# Altium schematic sheet EnclosurePinout.SchDoc
size A3
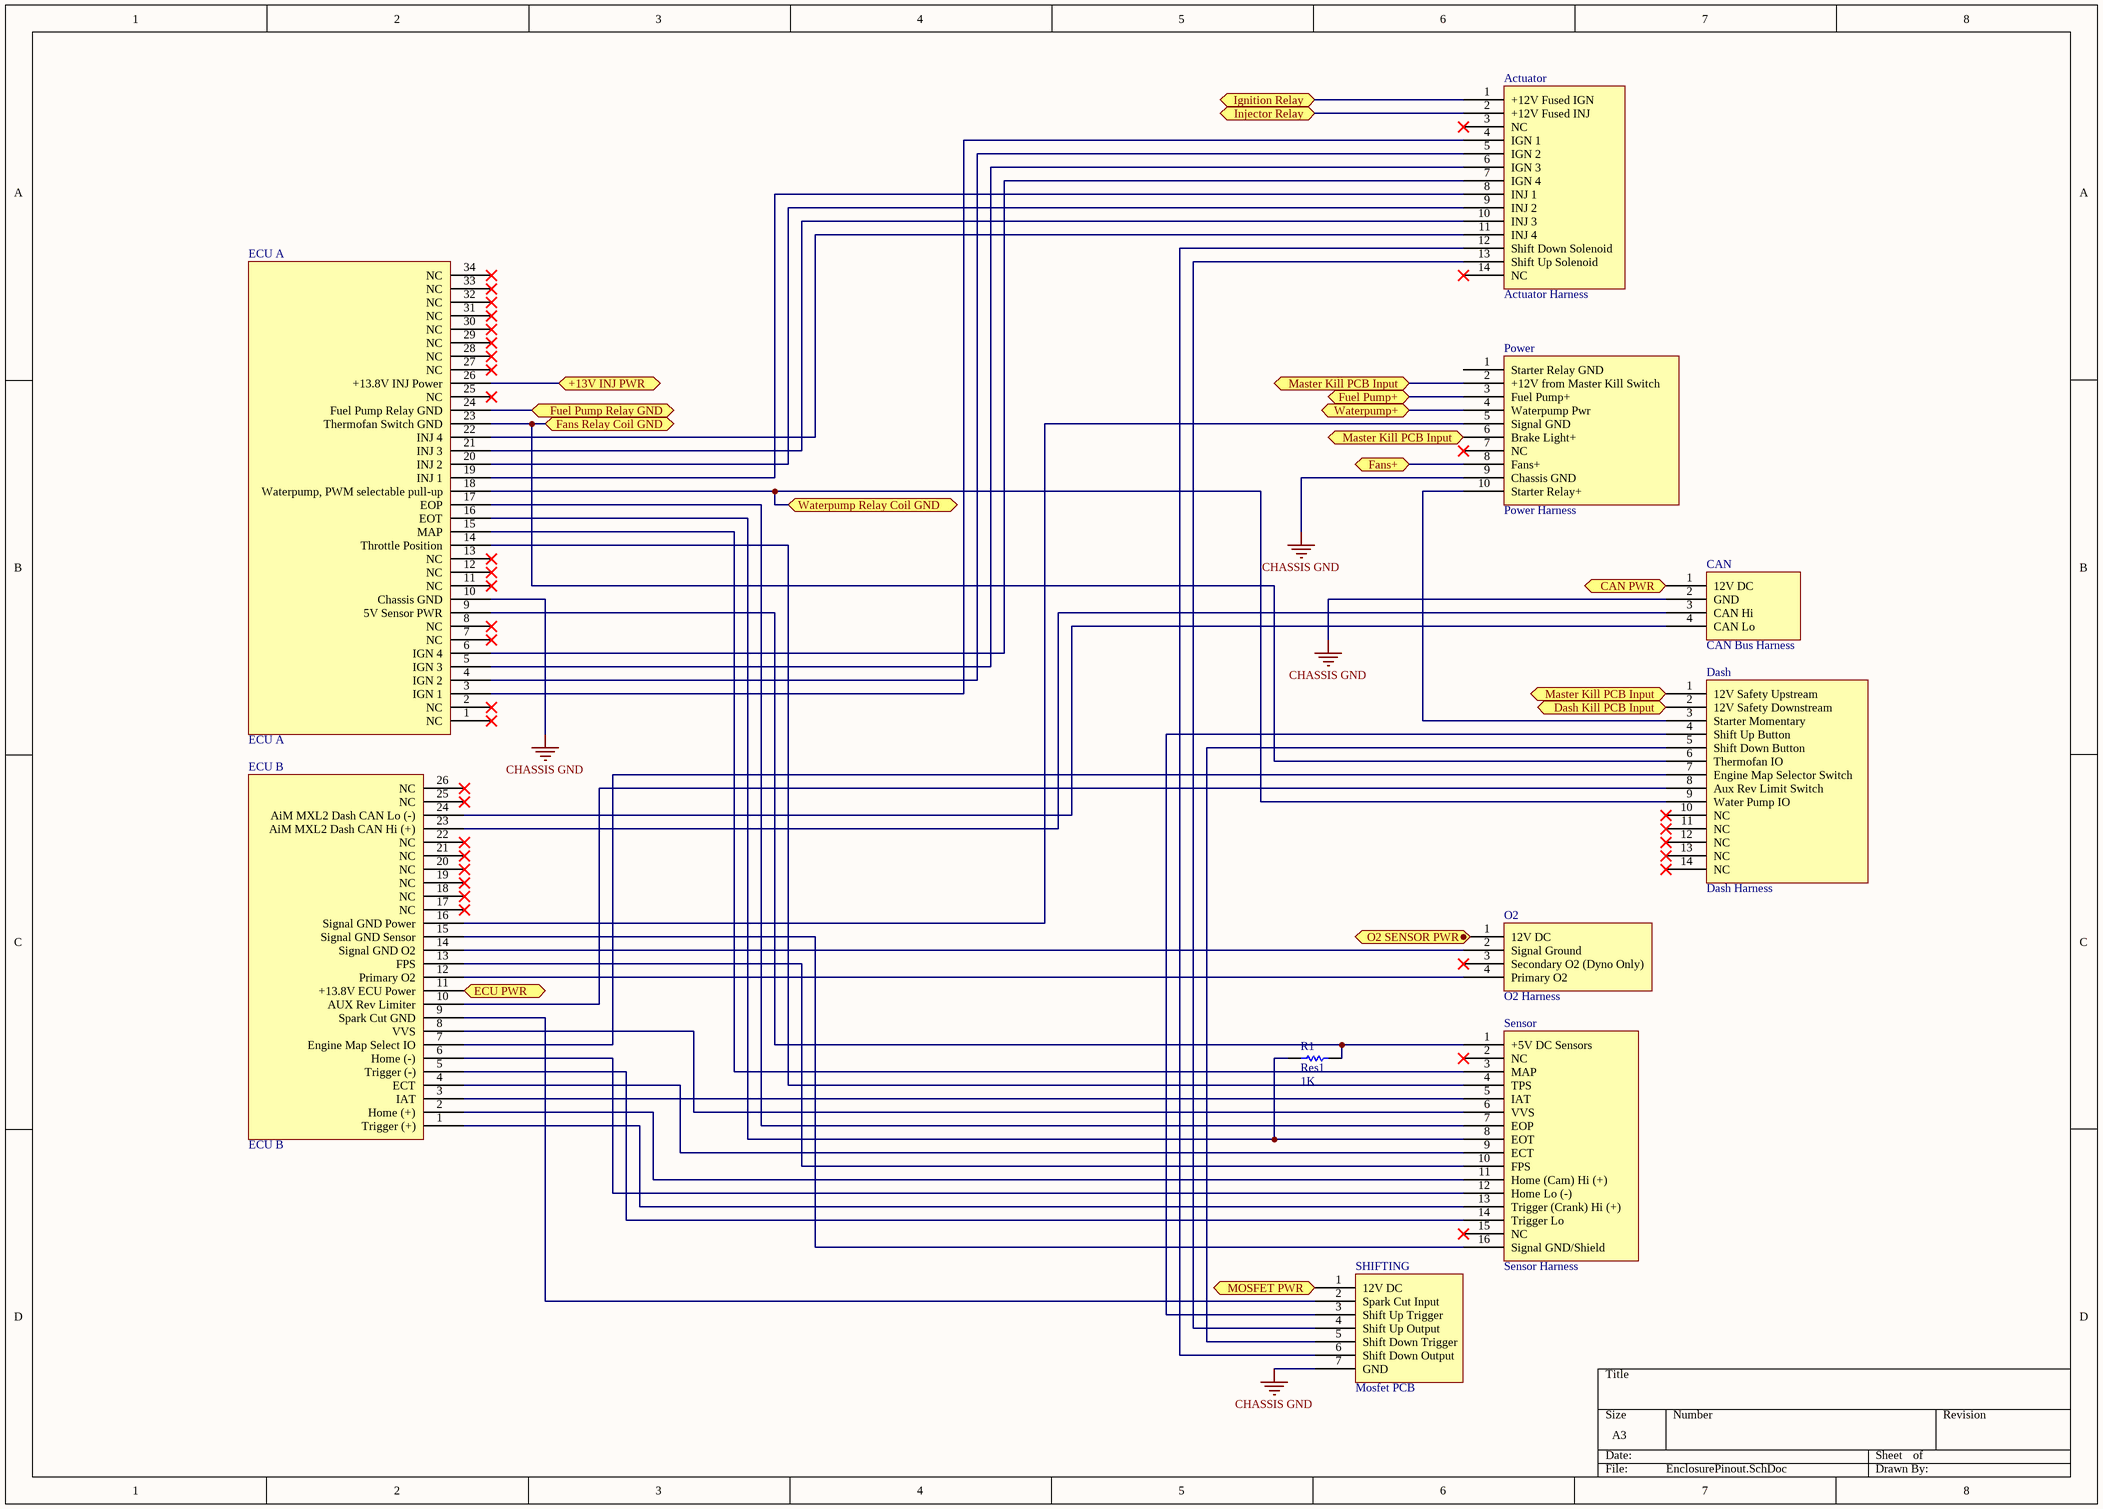
[diagram p0: EnclosurePinout.SchDoc]

## Parts
Actuator  Actuator Harness
CAN  CAN Bus Harness
Dash  Dash Harness
ECU_A  ECU A
ECU_B  ECU B
O2  O2 Harness
Power  Power Harness
R1  Res1  value 1K  [AXIAL-0.3]
Sensor  Sensor Harness
SHIFTING  Mosfet PCB

## Ports
+13V INJ PWR, CAN PWR, Dash Kill PCB Input, ECU PWR, Fans Relay Coil GND, Fans+, Fuel Pump Relay GND, Fuel Pump+, Ignition Relay, Injector Relay, Master Kill PCB Input, MOSFET PWR, O2 SENSOR PWR, Waterpump Relay Coil GND, Waterpump+

## Nets
CHASSIS GND: CAN.2(GND) ECU_A.10(Chassis_GND) Power.9(Chassis_GND) SHIFTING.7(GND)
+13V INJ PWR: ECU_A.26(+13.8V_INJ_Power) ; port +13V INJ PWR
CAN PWR: CAN.1(12V_DC) ; port CAN PWR
Dash Kill PCB Input: Dash.2(12V_Safety_Downstream) ; port Dash Kill PCB Input
ECU PWR: ECU_B.11(+13.8V_ECU_Power) ; port ECU PWR
Fans Relay Coil GND: Dash.6(Thermofan_IO) ECU_A.23(Thermofan_Switch_GND) ; port Fans Relay Coil GND
Fans+: Power.8(Fans+) ; port Fans+
Fuel Pump Relay GND: ECU_A.24(Fuel_Pump_Relay_GND) ; port Fuel Pump Relay GND
Fuel Pump+: Power.3(Fuel_Pump+) ; port Fuel Pump+
Ignition Relay: Actuator.1(+12V_Fused_IGN) ; port Ignition Relay
Injector Relay: Actuator.2(+12V_Fused_INJ) ; port Injector Relay
Master Kill PCB Input: Dash.1(12V_Safety_Upstream) Power.2(+12V_from_Master_Kill_Switch) Power.6(Brake_Light+) ; port Master Kill PCB Input
MOSFET PWR: SHIFTING.1(12V_DC) ; port MOSFET PWR
Waterpump Relay Coil GND: Dash.9(Water_Pump_IO) ECU_A.18(Waterpump,_PWM_selectable_pull-up) ; port Waterpump Relay Coil GND
Waterpump+: Power.4(Waterpump_Pwr) ; port Waterpump+
NetActuator_4: Actuator.4(IGN_1) ECU_A.3(IGN_1)
NetActuator_5: Actuator.5(IGN_2) ECU_A.4(IGN_2)
NetActuator_6: Actuator.6(IGN_3) ECU_A.5(IGN_3)
NetActuator_7: Actuator.7(IGN_4) ECU_A.6(IGN_4)
NetActuator_8: Actuator.8(INJ_1) ECU_A.19(INJ_1)
NetActuator_9: Actuator.9(INJ_2) ECU_A.20(INJ_2)
NetActuator_10: Actuator.10(INJ_3) ECU_A.21(INJ_3)
NetActuator_11: Actuator.11(INJ_4) ECU_A.22(INJ_4)
NetActuator_12: Actuator.12(Shift_Down_Solenoid) SHIFTING.6(Shift_Down_Output)
NetActuator_13: Actuator.13(Shift_Up_Solenoid) SHIFTING.4(Shift_Up_Output)
NetCAN_3: CAN.3(CAN_Hi) ECU_B.23(AiM_MXL2_Dash_CAN_Hi_(+))
NetCAN_4: CAN.4(CAN_Lo) ECU_B.24(AiM_MXL2_Dash_CAN_Lo_(-))
NetDash_3: Dash.3(Starter_Momentary) Power.10(Starter_Relay+)
NetDash_4: Dash.4(Shift_Up_Button) SHIFTING.3(Shift_Up_Trigger)
NetDash_5: Dash.5(Shift_Down_Button) SHIFTING.5(Shift_Down_Trigger)
NetDash_7: Dash.7(Engine_Map_Selector_Switch) ECU_B.7(Engine_Map_Select_IO)
NetDash_8: Dash.8(Aux_Rev_Limit_Switch) ECU_B.10(AUX_Rev_Limiter)
NetECU_A_9: ECU_A.9(5V_Sensor_PWR) R1.1 Sensor.1(+5V_DC_Sensors)
NetECU_A_14: ECU_A.14(Throttle_Position) Sensor.4(TPS)
NetECU_A_15: ECU_A.15(MAP) Sensor.3(MAP)
NetECU_A_16: ECU_A.16(EOT) R1.2 Sensor.8(EOT)
NetECU_A_17: ECU_A.17(EOP) Sensor.7(EOP)
NetECU_B_1: ECU_B.1(Trigger_(+)) Sensor.13(Trigger_(Crank)_Hi_(+))
NetECU_B_2: ECU_B.2(Home_(+)) Sensor.11(Home_(Cam)_Hi_(+))
NetECU_B_3: ECU_B.3(IAT) Sensor.5(IAT)
NetECU_B_4: ECU_B.4(ECT) Sensor.9(ECT)
NetECU_B_5: ECU_B.5(Trigger_(-)) Sensor.14(Trigger_Lo)
NetECU_B_6: ECU_B.6(Home_(-)) Sensor.12(Home_Lo_(-))
NetECU_B_8: ECU_B.8(VVS) Sensor.6(VVS)
NetECU_B_9: ECU_B.9(Spark_Cut_GND) SHIFTING.2(Spark_Cut_Input)
NetECU_B_12: ECU_B.12(Primary_O2) O2.4(Primary_O2)
NetECU_B_13: ECU_B.13(FPS) Sensor.10(FPS)
NetECU_B_14: ECU_B.14(Signal_GND_O2) O2.2(Signal_Ground)
NetECU_B_15: ECU_B.15(Signal_GND_Sensor) Sensor.16(Signal_GND/Shield)
NetECU_B_16: ECU_B.16(Signal_GND_Power) Power.5(Signal_GND)

Not connected (* = marked no-connect by the designer): Actuator 3(NC)* 14(NC)*; Dash 10(NC)* 11(NC)* 12(NC)* 13(NC)* 14(NC)*; ECU_A 1(NC)* 2(NC)* 7(NC)* 8(NC)* 11(NC)* 12(NC)* 13(NC)* 25(NC)* 27(NC)* 28(NC)* 29(NC)* 30(NC)* 31(NC)* 32(NC)* 33(NC)* 34(NC)*; ECU_B 17(NC)* 18(NC)* 19(NC)* 20(NC)* 21(NC)* 22(NC)* 25(NC)* 26(NC)*; O2 1(12V_DC) 3(Secondary_O2_(Dyno_Only))*; Power 1(Starter_Relay_GND) 7(NC)*; Sensor 2(NC)* 15(NC)*

## Library data of the parts
R1 = Res1: Resistor; Published: 8-Jun-2000; LatestRevisionDate: 17-Jul-2002; LatestRevisionNote: Re-released for DXP Platform.; PackageReference: AXIAL-0.3; Publisher: Altium Limited; PackageDescription: Axial Device, Thru-Hole; 2 Leads; 0.3 in Pin Spacing